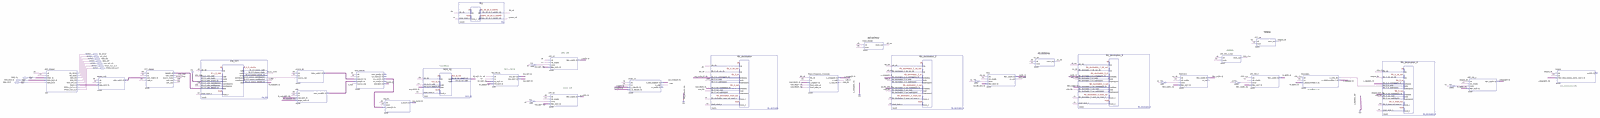
[diagram p0: schematic sheet, whole]
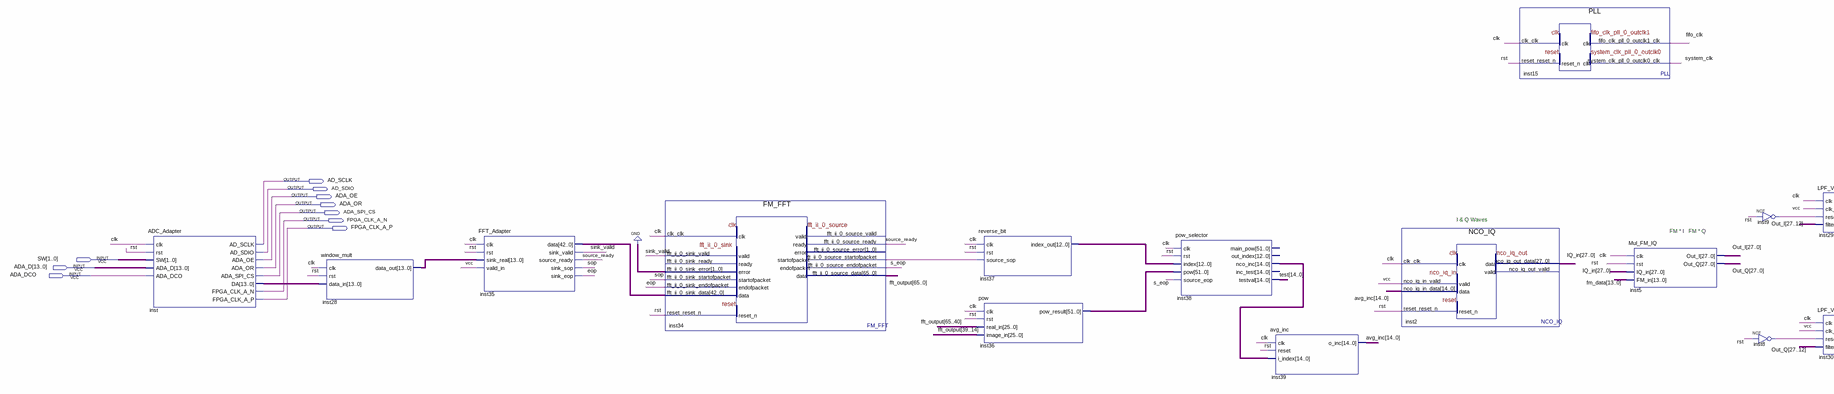
[diagram p1: schematic sheet, left part]
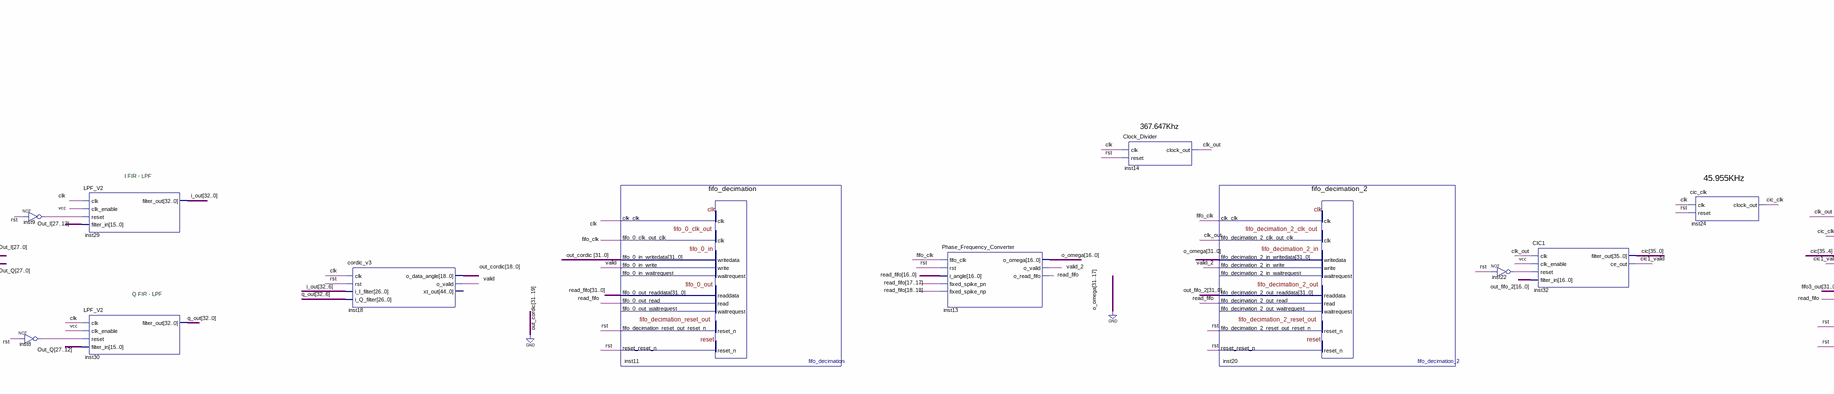
[diagram p2: schematic sheet, centre part]
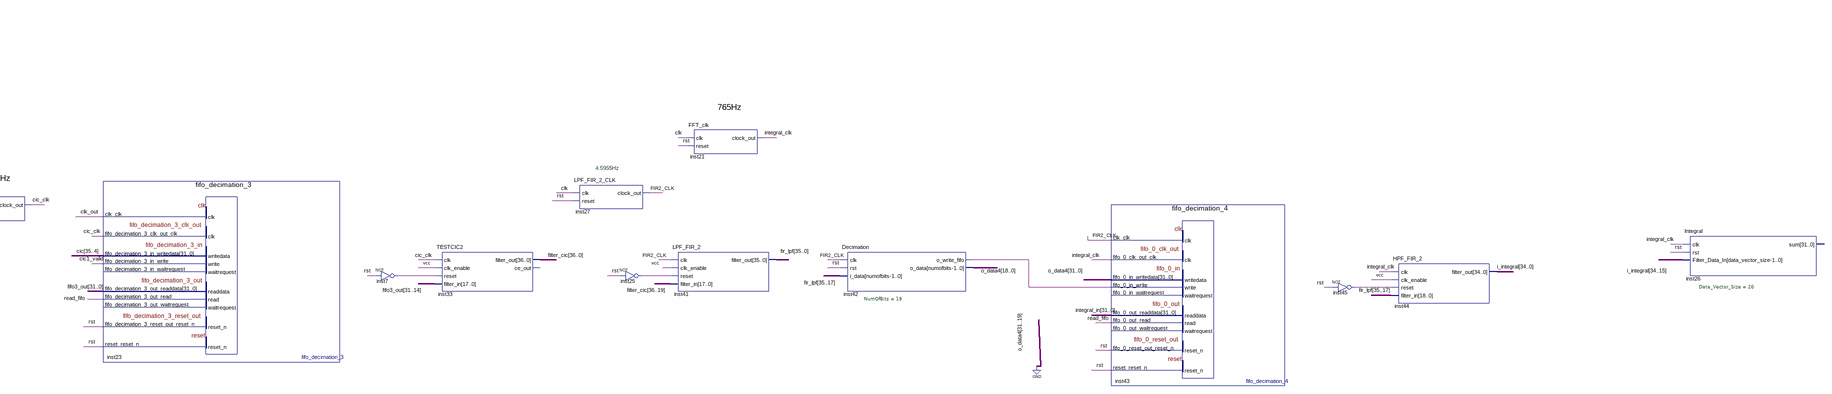
[diagram p3: schematic sheet, right part]
// Quartus schematic BDF_ADC.bdf as structural Verilog: 35 symbols, 10 pins
module BDF_ADC (
  input  [1:0] SW,
  input  [13:0] ADA_D,
  input  ADA_DCO,
  output AD_SCLK,
  output AD_SDIO,
  output ADA_OE,
  output ADA_OR,
  output ADA_SPI_CS,
  output FPGA_CLK_A_N,
  output FPGA_CLK_A_P
);

  wire cic1_valid, cic_clk, clk, clk_out, eop, fifo_clk, FIR2_CLK, inst7_out, inst8_out, inst9_out,
       inst22_out, inst25_out, inst34_fft_ii_0_source_startofpacket, inst42_o_write_fifo, inst45_out,
       integral_clk, read_fifo_1bit, rst, s_eop, sink_valid, sop, source_ready, system_clk, valid, valid_2,
       vcc;
  wire [12:0] inst37_index_out;
  wire [13:0] fm_data, inst28_data_out, inst_da;
  wire [14:0] avg_inc, inst38_nco_inc, test;
  wire [16:0] o_omega;
  wire [18:0] o_data4, out_cordic;
  wire [27:0] IQ_in, Out_I, Out_Q;
  wire [31:0] fifo3_out, integral_in, out_fifo_2, read_fifo;
  wire [32:0] i_out, q_out;
  wire [34:0] i_integral;
  wire [35:0] cic, fir_lpf;
  wire [36:0] filter_cic;
  wire [42:0] inst35_data;
  wire [51:0] inst36_pow_result;
  wire [65:0] fft_output;

  ADC_Adapter inst (
    .clk(clk), .rst(rst), .SW(SW), .ADA_D(ADA_D), .ADA_DCO(ADA_DCO), .AD_SCLK(AD_SCLK), .AD_SDIO(AD_SDIO),
    .ADA_OE(ADA_OE), .ADA_OR(ADA_OR), .ADA_SPI_CS(ADA_SPI_CS), .DA(inst_da), .FPGA_CLK_A_N(FPGA_CLK_A_N),
    .FPGA_CLK_A_P(FPGA_CLK_A_P));
  window_mult inst28 (.clk(clk), .rst(rst), .data_in(inst_da), .data_out(inst28_data_out));
  FFT_Adapter inst35 (
    .clk(clk), .rst(rst), .sink_real(inst28_data_out), .valid_in(vcc), .data(inst35_data),
    .sink_valid(sink_valid), .source_ready(source_ready), .sink_sop(sop), .sink_eop(eop));
  FM_FFT inst34 (
    .clk_clk(clk), .fft_ii_0_sink_valid(sink_valid), .fft_ii_0_sink_error(2'b00),
    .fft_ii_0_sink_startofpacket(sop), .fft_ii_0_sink_endofpacket(eop), .fft_ii_0_sink_data(inst35_data),
    .fft_ii_0_source_ready(source_ready), .reset_reset_n(rst),
    .fft_ii_0_source_startofpacket(inst34_fft_ii_0_source_startofpacket),
    .fft_ii_0_source_endofpacket(s_eop), .fft_ii_0_source_data(fft_output));  // open: fft_ii_0_sink_ready, fft_ii_0_source_valid, fft_ii_0_source_error
  reverse_bit inst37 (
    .clk(clk), .rst(rst), .source_sop(inst34_fft_ii_0_source_startofpacket), .index_out(inst37_index_out));
  pow inst36 (
    .clk(clk), .rst(rst), .real_in(fft_output[65:40]), .image_in(fft_output[39:14]),
    .pow_result(inst36_pow_result));
  pow_selector inst38 (
    .clk(clk), .rst(rst), .index(inst37_index_out), .pow(inst36_pow_result), .source_eop(s_eop),
    .nco_inc(inst38_nco_inc), .testval(test));  // open: main_pow, out_index, inc_test
  avg_inc inst39 (.clk(clk), .reset(rst), .i_index(inst38_nco_inc), .o_inc(avg_inc));
  NCO_IQ inst2 (
    .clk_clk(clk), .nco_iq_in_valid(vcc), .nco_iq_in_data(avg_inc), .reset_reset_n(rst),
    .nco_iq_out_data(IQ_in));  // open: nco_iq_out_valid
  PLL inst15 (
    .clk_clk(clk), .reset_reset_n(rst), .fifo_clk_pll_0_outclk1_clk(fifo_clk),
    .system_clk_pll_0_outclk0_clk(system_clk));
  Mul_FM_IQ inst5 (.clk(clk), .rst(rst), .IQ_in(IQ_in), .FM_in(fm_data), .Out_I(Out_I), .Out_Q(Out_Q));
  not inst9 (inst9_out, rst);
  not inst8 (inst8_out, rst);
  LPF_V2 inst29 (.clk(clk), .clk_enable(vcc), .reset(inst9_out), .filter_in(Out_I[27:12]), .filter_out(i_out));
  LPF_V2 inst30 (.clk(clk), .clk_enable(vcc), .reset(inst8_out), .filter_in(Out_Q[27:12]), .filter_out(q_out));
  cordic_v3 inst18 (
    .clk(clk), .rst(rst), .i_I_filter(i_out[32:6]), .i_Q_filter(q_out[32:6]), .o_data_angle(out_cordic),
    .o_valid(valid));  // open: xt_out
  fifo_decimation inst11 (
    .clk_clk(clk), .fifo_0_clk_out_clk(fifo_clk), .fifo_0_in_writedata({{13{1'b0}}, out_cordic}),
    .fifo_0_in_write(valid), .fifo_0_out_read(read_fifo_1bit), .fifo_decimation_reset_out_reset_n(rst),
    .reset_reset_n(rst), .fifo_0_out_readdata(read_fifo));  // open: fifo_0_in_waitrequest, fifo_0_out_waitrequest
  Phase_Frequency_Converter inst13 (
    .fifo_clk(fifo_clk), .rst(rst), .i_angle(read_fifo[16:0]), .fixed_spike_pn(read_fifo[17]),
    .fixed_spike_np(read_fifo[18]), .o_omega(o_omega), .o_valid(valid_2), .o_read_fifo(read_fifo_1bit));
  Clock_Divider inst14 (.clk(clk), .reset(rst), .clock_out(clk_out));
  fifo_decimation_2 inst20 (
    .clk_clk(fifo_clk), .fifo_decimation_2_clk_out_clk(clk_out),
    .fifo_decimation_2_in_writedata({{15{1'b0}}, o_omega}), .fifo_decimation_2_in_write(valid_2),
    .fifo_decimation_2_out_read(read_fifo_1bit), .fifo_decimation_2_reset_out_reset_n(rst),
    .reset_reset_n(rst), .fifo_decimation_2_out_readdata(out_fifo_2));  // open: fifo_decimation_2_in_waitrequest, fifo_decimation_2_out_waitrequest
  not inst22 (inst22_out, rst);
  CIC1 inst32 (
    .clk(clk_out), .clk_enable(vcc), .reset(inst22_out), .filter_in(out_fifo_2[16:0]), .filter_out(cic),
    .ce_out(cic1_valid));
  cic_clk inst24 (.clk(clk), .reset(rst), .clock_out(cic_clk));
  fifo_decimation_3 inst23 (
    .clk_clk(clk_out), .fifo_decimation_3_clk_out_clk(cic_clk), .fifo_decimation_3_in_writedata(cic[35:4]),
    .fifo_decimation_3_in_write(cic1_valid), .fifo_decimation_3_out_read(read_fifo_1bit),
    .fifo_decimation_3_reset_out_reset_n(rst), .reset_reset_n(rst), .fifo_decimation_3_out_readdata(fifo3_out));  // open: fifo_decimation_3_in_waitrequest, fifo_decimation_3_out_waitrequest
  not inst7 (inst7_out, rst);
  TESTCIC2 inst33 (
    .clk(cic_clk), .clk_enable(vcc), .reset(inst7_out), .filter_in(fifo3_out[31:14]), .filter_out(filter_cic));  // open: ce_out
  LPF_FIR_2_CLK inst27 (.clk(clk), .reset(rst), .clock_out(FIR2_CLK));
  not inst25 (inst25_out, rst);
  FFT_clk inst21 (.clk(clk), .reset(rst), .clock_out(integral_clk));
  LPF_FIR_2 inst41 (
    .clk(FIR2_CLK), .clk_enable(vcc), .reset(inst25_out), .filter_in(filter_cic[36:19]), .filter_out(fir_lpf));
  Decimation #(.NumOfBits(19)) inst42 (
    .clk(FIR2_CLK), .rst(rst), .i_data(fir_lpf[35:17]), .o_write_fifo(inst42_o_write_fifo), .o_data(o_data4));
  fifo_decimation_4 inst43 (
    .clk_clk(FIR2_CLK), .fifo_0_clk_out_clk(integral_clk), .fifo_0_in_writedata({{13{1'b0}}, o_data4}),
    .fifo_0_in_write(inst42_o_write_fifo), .fifo_0_out_read(read_fifo_1bit), .fifo_0_reset_out_reset_n(rst),
    .reset_reset_n(rst), .fifo_0_out_readdata(integral_in));  // open: fifo_0_in_waitrequest, fifo_0_out_waitrequest
  not inst45 (inst45_out, rst);
  HPF_FIR_2 inst44 (
    .clk(integral_clk), .clk_enable(vcc), .reset(inst45_out), .filter_in(fir_lpf[35:17]),
    .filter_out(i_integral));
  Integral #(.Data_Vector_Size(20)) inst26 (
    .clk(integral_clk), .rst(rst), .Filter_Data_In(i_integral[34:15]));  // open: sum

  // Notes on the sheet:
  //   765Hz
  //   367.647Khz
  //   4.5955Hz
  //   I FIR - LPF
  //   45.955KHz
  //   I & Q Waves
  //   FM * I   FM * Q
  //   Q FIR - LPF
endmodule
